# Altium schematic sheet M10S Breakout Schematic.SchDoc
size A4; SheetNumber: 1; SheetTotal: 1
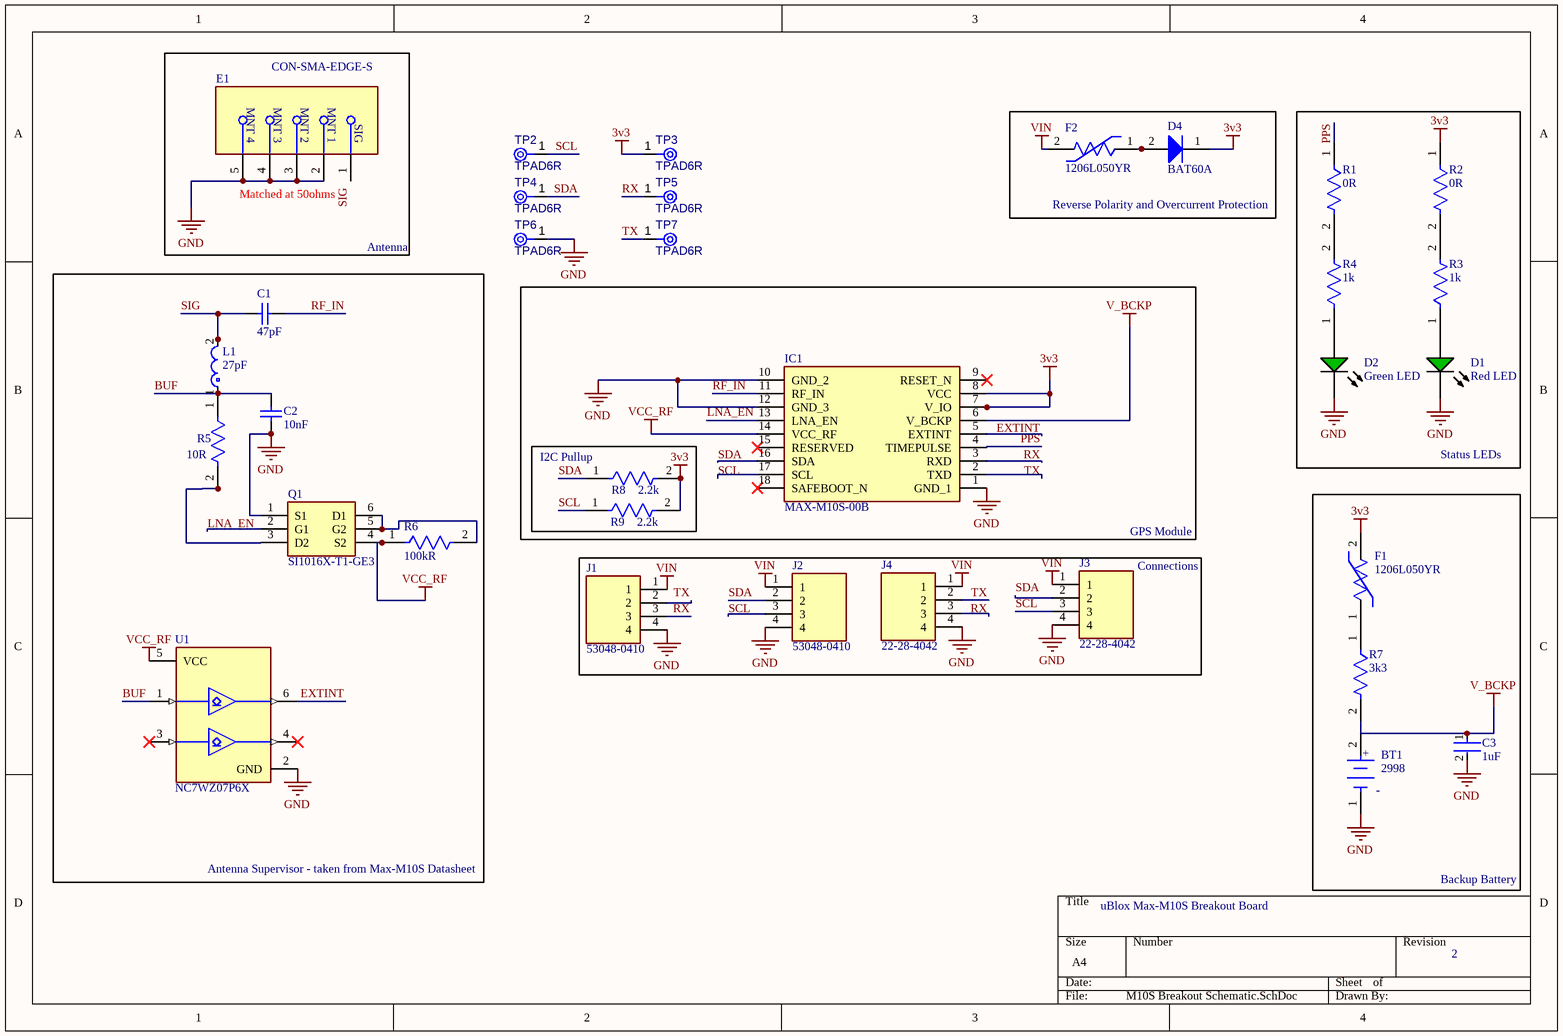
[diagram p0: M10S Breakout Schematic.SchDoc]

## Parts
BT1  2998  [FP-2998-MFG]
C1  47pF  [CAPC1608X90X35ML10T15]
C2  10nF  [CAPC1608X90X35LL10T15]
C3  1uF  [FP-GCM188-0_1-IPC_B]
D1  Red LED  [AVAG-HSMX-C190_V]
D2  Green LED  [AVAG-HSMX-C190_V]
D4  BAT60A  [INF-SOD323_V]
E1  CON-SMA-EDGE-S  [FP-CON-SMA-EDGE-S-MFG]
F1  1206L050YR  [FP-1206L050YR-MFG]
F2  1206L050YR  [FP-1206L050YR-MFG]
IC1  MAX-M10S-00B  [MAXM10S00B]
J1  53048-0410  [530480410]
J2  53048-0410  [530480410]
J3  22-28-4042  [HDRV4W66P0X254_1X4_1016X249X1003P]
J4  22-28-4042  [HDRV4W66P0X254_1X4_1016X249X1003P]
L1  27pF  [FP-LQG18HH_00-IPC_C]
Q1  SI1016X-T1-GE3  [SOT50P160X60-6N]
R1  0R  [FP-AC0603-IPC_A]
R2  0R  [FP-AC0603-IPC_A]
R3  1k  [FP-AC0603-MFG]
R4  1k  [FP-AC0603-MFG]
R5  10R  [FP-AC1206-MFG]
R6  100kR  [FP-AC0603-MFG]
R7  3k3  [FP-AC0603-IPC_C]
R8  2.2k  [FP-AC0603-IPC_B]
R9  2.2k  [FP-AC0603-IPC_B]
TP2  TPAD6R  [TP06R]  (no BOM)
TP3  TPAD6R  [TP06R]  (no BOM)
TP4  TPAD6R  [TP06R]  (no BOM)
TP5  TPAD6R  [TP06R]  (no BOM)
TP6  TPAD6R  [TP06R]  (no BOM)
TP7  TPAD6R  [TP06R]  (no BOM)
U1  NC7WZ07P6X  [FP-419AD-01-MFG]

## Blocks framed on the sheet
Reverse Polarity and Overcurrent Protection: D4 F2
Status LEDs: D1 D2 R1-R4
GPS Module: IC1
I2C Pullup: R8 R9
Backup Battery: BT1 C3 F1 R7

## Nets
3v3: D4.1(K) F1.2 IC1.7(V_IO) IC1.8(VCC) R2.1 R8.2 R9.2 TP3.1(TP)
GND: BT1.1(C) C2.2 C3.2 D1.2(K) D2.2(K) E1.2(MNT_1) E1.3(MNT_2) E1.4(MNT_3) E1.5(MNT_4) IC1.1(GND_1) IC1.10(GND_2) IC1.12(GND_3) J1.4 J2.4 J3.4 J4.4 Q1.1(S1) TP6.1(TP) U1.2(GND)
V_BCKP: BT1.2(A) C3.1 IC1.6(V_BCKP) R7.2
VCC_RF: IC1.14(VCC_RF) Q1.4(S2) R6.1 U1.5(VCC)
VIN: F2.2 J1.1 J2.1 J3.1 J4.1
BUF: C2.1 L1.1 R5.1 U1.1(A1)
EXTINT: IC1.5(EXTINT) U1.6(Y1)
LNA_EN: IC1.13(LNA_EN) Q1.2(G1)
PPS: IC1.4(TIMEPULSE) R1.1
RF_IN: C1.2 IC1.11(RF_IN)
RX: IC1.3(RXD) J1.3 J4.3 TP5.1(TP)
SCL: IC1.17(SCL) J2.3 J3.3 R9.1 TP2.1(TP)
SDA: IC1.16(SDA) J2.2 J3.2 R8.1 TP4.1(TP)
SIG: C1.1 L1.2
TX: IC1.2(TXD) J1.2 J4.2 TP7.1(TP)
NetD1_1: D1.1(A) R3.1
NetD2_1: D2.1(A) R4.1
NetD4_2: D4.2(A) F2.1
NetF1_1: F1.1 R7.1
NetQ1_3: Q1.3(D2) R5.2
NetQ1_5: Q1.5(G2) Q1.6(D1) R6.2
NetR1_2: R1.2 R4.2
NetR2_2: R2.2 R3.2

Not connected (* = marked no-connect by the designer): E1 1; IC1 9(RESET_N)* 15(RESERVED)* 18(SAFEBOOT_N)*; U1 3(A2)* 4(Y2)*

## Notes on the sheet
- (near E1) Matched at 50ohms
- Antenna
- Connections
- Antenna Supervisor - taken from Max-M10S Datasheet
- uBlox Max-M10S Breakout Board
- 2
- Labels drawn without touching a wire or pin: SIG
- (in symbol CMP-002-00071-2) SIG
- (in symbol CMP-19636-000010-1) +; -

## Library data of the parts
BT1 = CMP-19636-000010-1: BATTERY RETAINER COIN 6.8MM SMD; Number of Batteries: 1; Package Quantity: 100; Mount: Surface Mount; Case/Package: SMD/SMT; Number of Cells: 1; REACH SVHC: No SVHC; Height: 2.9mm; Contact Material: Bronze; Material: Bronze; Lead Free: Lead Free; Termination: SMD/SMT; Color: Silver
C1 = CMP-2006-02325-1: Manufacturer: Murata; Part Number: GCM1885C1H470JA16D
C2 = CMP-2006-02373-1: Part Number: GCM188R71H103KA37D; Manufacturer: Murata
C3 = CMP-2006-02358-2: Ceramic Capacitor for Automotive 1uF  ±10% 16VDC X7R 0603 Paper T/R; Voltage Rating (DC): 16V; Capacitance: 1uF; Case Code (Imperial): 0603; Depth: 0.8mm; Lead Free: Lead Free; Tolerance: 10%; Ratings: AEC-Q200; Width: 0.031inch; Packaging: Tape and Reel; Voltage Rating: 16V; Thickness: 0.035inch; Mount: Surface Mount; Case Code (Metric): 1608; Radiation Hardening: No; Min Operating Temperature: -55°C; Dielectric: X7R; Length: 1.6mm; Max Operating Temperature: 125°C; Case/Package: 0603
D1 D2 = CMP-1744-00002-1: Chip LED, Green, 2.2 V, -40 to 85 degC, 2-Pin SMD, RoHS, Tape and Reel; Frequency: 400 KHz; Max Supply Voltage: 5.5 V; Access Time: 3500 ns; Clock Frequency: 100 KHz; Case\Package: SOIC; Density: 32 kb; Nominal Supply Current: 2 mA; Interface: Serial; Min Supply Voltage: 1.7 V; Packaging: Tape and Reel; PackageReference: HSMX-C190; ComponentLink2URL: http://docs.avagotech.com/docs/AV02-0551EN; RoHSCompliant: true; Pins: 8; REACH SVHC: No SVHC; Max Operating Temperature: 85 degC; Width: 4 mm; Radiation Hardening: No; Package Quantity: 3000; ComponentLink3Description: Package Specification; ComponentLink1Description: Manufacturer URL; Min Operating Temperature: -40 degC; PackageDescription: 2-Pin Surface Mount Device, Body 1.6 x 0.8 mm, Height 0.9 mm; Max Clock Frequency: 100 KHz; Height: 1.5 mm; ComponentLink1URL: http://www.avagotech.com/; DatasheetVersion: Mar-12; ComponentLink2Description: Datasheet; Mount: Surface Mount; Length: 5 mm; ComponentLink3URL: http://www.fairchildsemi.com/dwg/MA/MA03D.pdf
D4 = CMP-1183-00008-2: Silicon Schottky Diode, -55 to 85 degC, SOD323, Reel, Green; Manufacturer: Infineon; Green: TRUE; VR (max): 10Â V; IF (max): 3,000Â mA; VF (max): 370Â mV; CT (max): 35Â pF; Configuration: Single; PackageDescription: 3-Pin Small Outline Transistor Package, 1.25 x 2 mm Body, 0.65 mm Pitch; PartNumber: BAT60A; Mounting Technology: Surface Mount; PackageReference: SOT323; ComponentLink1Description: Manufacturer URL; Packing: Reel; ComponentLink3URL: http://www.infineon.com/dgdl/SOT323-Package_Overview.pdf?folderId=db3a30431936bc4b0119533e1dcb3c92&fileId=db3a30431936bc4b011953495f283cb1; ComponentLink2URL: http://www.infineon.com/dgdl/bat60aseries.pdf?folderId=db3a304313d846880113def5812204a1&fileId=db3a304313d846880113def70c9304a9; ComponentLink1URL: http://www.infineon.com/; ComponentLink2Description: Datasheet; ComponentLink3Description: Package Specification
E1 = CMP-002-00071-2: RF SMA Connector, 1 Contact(s), Female, Board Mount, Surface Mount Terminal, Locking
F1 F2 = CMP-08606-000073-1: PTC RESET FUSE 6V 500MA 1206; Trip Current: 1A; Current Rating: 100A; Resistance: 700mR; Approvals: cULus; Max Power Dissipation: 600mW; Time to Trip: 0.1s; Hold Current: 500mA; Min Operating Temperature: -40°C; Voltage Rating (DC): 6V; Working Voltage: 6V; Package Quantity: 4000; Termination: SMD/SMT; Lead Free: Lead Free; REACH SVHC: No SVHC; Series: 1206L; Max Voltage Rating (DC): 6V; Height: 0.75mm; Terminal Material: Copper; Packaging: Tape and Reel; Case Code (Imperial): 1206; Length: 3.4mm; RoHS Compliant: Yes; Operating Supply Voltage: 6V; Case Code (Metric): 3216; Width: 1.8mm; Max Current Rating: 100A; Case/Package: 1206; Power Dissipation: 600mW; Max Operating Temperature: 85°C; Voltage Rating: 6V
IC1 = MAX-M10S-00B: Integrated Circuit; Manufacturer_Name: U-Blox; Datasheet Link: https://content.u-blox.com/sites/default/files/MAX-M10S_IntegrationManual_UBX-20053088.pdf; Height: 2.7mm; Manufacturer_Part_Number: MAX-M10S-00B; Mouser Part Number: 377-MAX-M10S-00B; Mouser Price/Stock: https://www.mouser.co.uk/ProductDetail/u-blox/MAX-M10S-00B?qs=A6eO%252BMLsxmT0PfQYPb7LLQ%3D%3D
J1 J2 = 53048-0410: Connector; Manufacturer_Name: Molex; Datasheet Link: https://www.molex.com/pdm_docs/sd/530480410_sd.pdf; Height: 3.7mm; Manufacturer_Part_Number: 53048-0410; Mouser Part Number: 538-53048-0410; Mouser Price/Stock: https://www.mouser.co.uk/ProductDetail/Molex/53048-0410?qs=359VwiUTsp2msj5Tobchuw%3D%3D
J3 J4 = 22-28-4042: Connector; Manufacturer_Name: Molex; Datasheet Link: https://www.molex.com/content/dam/molex/molex-dot-com/products/automated/en-us/salesdrawingpdf/423/42375/022284042_sd.pdf?inline; Height: 10.03mm; Manufacturer_Part_Number: 22-28-4042; Mouser Part Number: 538-22-28-4042; Mouser Price/Stock: https://www.mouser.co.uk/ProductDetail/Molex/22-28-4042?qs=GAPJcf4kvdu6DqYOOlzdaQ%3D%3D
L1 = CMP-06042-012021-1: Multilayer type Inductor for Automotive 27nH ±5% 0.54Ω 500mA 0603; DC Resistance (DCR): 4.18mR; Packaging: Tape and Reel; Case/Package: 0603; Package Quantity: 4000; Inductance: 27nH; Termination: SMD/SMT
Q1 = SI1016X-T1-GE3: Transistor; Manufacturer_Name: Vishay; Datasheet Link: https://componentsearchengine.com/Datasheets/1/SI1016X-T1-GE3.pdf; Height: 0.6mm; Manufacturer_Part_Number: SI1016X-T1-GE3; Mouser Part Number: 781-SI1016X-T1-GE3; Mouser Price/Stock: https://www.mouser.co.uk/ProductDetail/Vishay-Semiconductors/SI1016X-T1-GE3?qs=tWM4QuTcS4UASHtTakd5XQ%3D%3D; Arrow Part Number: SI1016X-T1-GE3; Arrow Price/Stock: https://www.arrow.com/en/products/si1016x-t1-ge3/vishay?region=nac
R1 R2 = CMP-03412-047235-1: RES 0Ω 0.00% 0.1W 0603; Tolerance: 5%; Resistance: 0mR; Case/Package: 0603; RoHS Compliant: Yes; Lead Free: Lead Free
R3 R4 = CMP-2000-04863-2: RES 1kΩ 5.00% 0.1W 0603; Voltage Rating: 50V; Max Power Dissipation: 100mW; Tolerance: 5%; Resistance: 1kR; Temperature Coefficient: 100ppm/°C; Height: 0.45mm; Case Code (Metric): 1608; Length: 1.6mm; Termination: SMD/SMT; Series: AC; Resistor Type: Thick Film; Max Operating Temperature: 155°C; Features: Moisture Resistant; Width: 0.8mm; Case Code (Imperial): 0603; Case/Package: 0603; Power Rating: 100mW; Number of Terminations: 2; Ratings: AEC-Q200; Military Standard: Not; Min Operating Temperature: -55°C; Lead Free: Lead Free; Depth: 0.8mm; Packaging: Tape and Reel; Construction: Rectangular; Size Code: 0603; RoHS Compliant: Yes; Radiation Hardening: No; Contact Plating: Tin
R5 = CMP-03412-007974-1: RES SMD 10 OHM 5% 1/4W 1206; Manufacturer Part Number: AC1206JR-0710RL; Manufacturer: Yageo; Automotive Grade: Grade 0; Value: 10Ω; Power Rating: 0.25W; Voltage Rating: 200V; Tolerance: 0.05; ComponentLink2URL: http://www.yageo.com/NewPortal/yageodocoutput?fileName=/pdf/R-Chip/PYu-AC_51_RoHS_L_6.pdf; Mouser Description: Res Thick Film 1206 10 Ohm 5% 0.25W(1/4W) ±200ppm/C Epoxy Pad SMD Automotive T/R; Footprint Url: http://www.yageo.com/exep/pages/download/literatures/PYu-R_Mount_10.pdf; Category: Res; Height: 0.65mm; ComponentLink2Description: Datasheet; Octopart: https://octopart.com/ac1206jr-0710rl-yageo-30511263; Lead Free: Yes; Temperature Range High: +155°C; Composition: Thick Film; Device Class L2: Resistors; Digikey Description: RES SMD 10 OHM 5% 1/4W 1206; Automotive: Yes; Temperature: -55°C to +155°C; Device Class L3: Chip SMD Resistors; Series: AC; Package: AC1206; Temperature Range Low: -55°C; Resistance: 10Ω; Device Class L1: Passive Components; Ipc Land Pattern Name: RESC310160X55; RoHS: TRUE
R6 = CMP-2000-04816-3: RES 100KΩ 1.00% 0.1W 0603; Temperature Coefficient: 100ppm/°C; Voltage Rating: 50V; Max Power Dissipation: 100mW; Tolerance: 1%; Working Voltage: 75V; Min Operating Temperature: -55°C; Case Code (Imperial): 0603; Width: 0.031inch; Max Operating Temperature: 155°C; Military Standard: Not; Technology: THICK FILM; Ratings: AEC-Q200; Features: Moisture Resistant; Construction: Rectangular; Resistor Type: Thick Film; RoHS Compliant: Yes; Case Code (Metric): 1608; Termination: SMD/SMT; Series: AC; Lead Free: Lead Free; Length: 1.6mm; Depth: 0.8mm; Height: 0.022inch; Power Rating: 100mW; Package Quantity: 1; Packaging: Tape and Reel; Case/Package: 0603; Number of Terminations: 2; Resistance: 100kR; Moisture Sensitivity Level: 1
R7 = CMP-03412-024727-2: RES 3.3KΩ 1.00% 0.1W 0603; Temperature Coefficient: 100ppm/°C; Resistance: 3.3kR; Voltage Rating: 50V; Power Rating: 100mW; Tolerance: 1%; Resistor Type: Thick Film; Length: 1.6mm; Packaging: Tape and Reel; Case Code (Metric): 1608; Series: AC; Min Operating Temperature: -55°C; Case/Package: 0603; Depth: 0.8mm; Features: Moisture Resistant; Width: 0.8mm; Ratings: AEC-Q200; Case Code (Imperial): 0603; Size Code: 0603; RoHS Compliant: Yes; Military Standard: Not; Termination: SMD/SMT; Height: 0.45mm; Max Operating Temperature: 155°C; Max Power Dissipation: 100mW; Number of Terminations: 2; Lead Free: Lead Free; Construction: Rectangular
R8 R9 = CMP-2000-04835-3: RES 2.2KΩ 1.00% 0.1W 0603; Tolerance: 1%; Max Power Dissipation: 100mW; Temperature Coefficient: 100ppm/°C; Voltage Rating: 50V; Resistance: 2.2kR; Features: Moisture Resistant; Size Code: 0603; Termination: SMD/SMT; Packaging: Tape and Reel; Min Operating Temperature: -55°C; Case/Package: 0603; Width: 0.031inch; Case Code (Metric): 1608; Package Quantity: 1; Height: 0.022inch; Number of Terminations: 2; Depth: 0.8mm; Construction: Rectangular; Power Rating: 100mW; Ratings: AEC-Q200; Series: AC; Case Code (Imperial): 0603; RoHS Compliant: Yes; Resistor Type: Thick Film; Military Standard: Not; Length: 0.063inch; Max Operating Temperature: 155°C; Lead Free: Lead Free
TP2-TP7 = CMP-00028-00002-2: 0.6mm round; Pins: 1
U1 = CMP-2000-06822-2: IC BUF NON-INVERT 5.5V SC70-6; Propagation Delay: 12.6ns; Max Power Dissipation: 180mW; High Level Output Current: 32mA; Number of Outputs: 2; Number of Bits per Element: 1; Polarity: Non-Inverting; Max Supply Current: 24mA; Turn-On Delay Time: 11.5ns; Logic Function: Buffer; Min Supply Voltage: 1.65V; Quiescent Current: 1uA; REACH SVHC: No SVHC; Lead Free: Lead Free; Packaging: Tape and Reel; Low Level Output Current: 32mA; Number of Channels: 2; Number of Output Lines: 2; Number of Bits: 2; Min Operating Temperature: -40°C; Radiation Hardening: No; Number of Elements: 2; Number of Pins: 6; Number of Inputs: 2; Max Supply Voltage: 5.5V; Package Quantity: 1; Termination: SMD/SMT; Number of Input Lines: 2; Number of Circuits: 2; Weight: 0.028g; Max Operating Temperature: 85°C; Case/Package: SC; Length: 2mm; Width: 1.25mm; Mount: Surface Mount; Height: 1mm